# EAGLE design board (EAGLE 9.3.0)
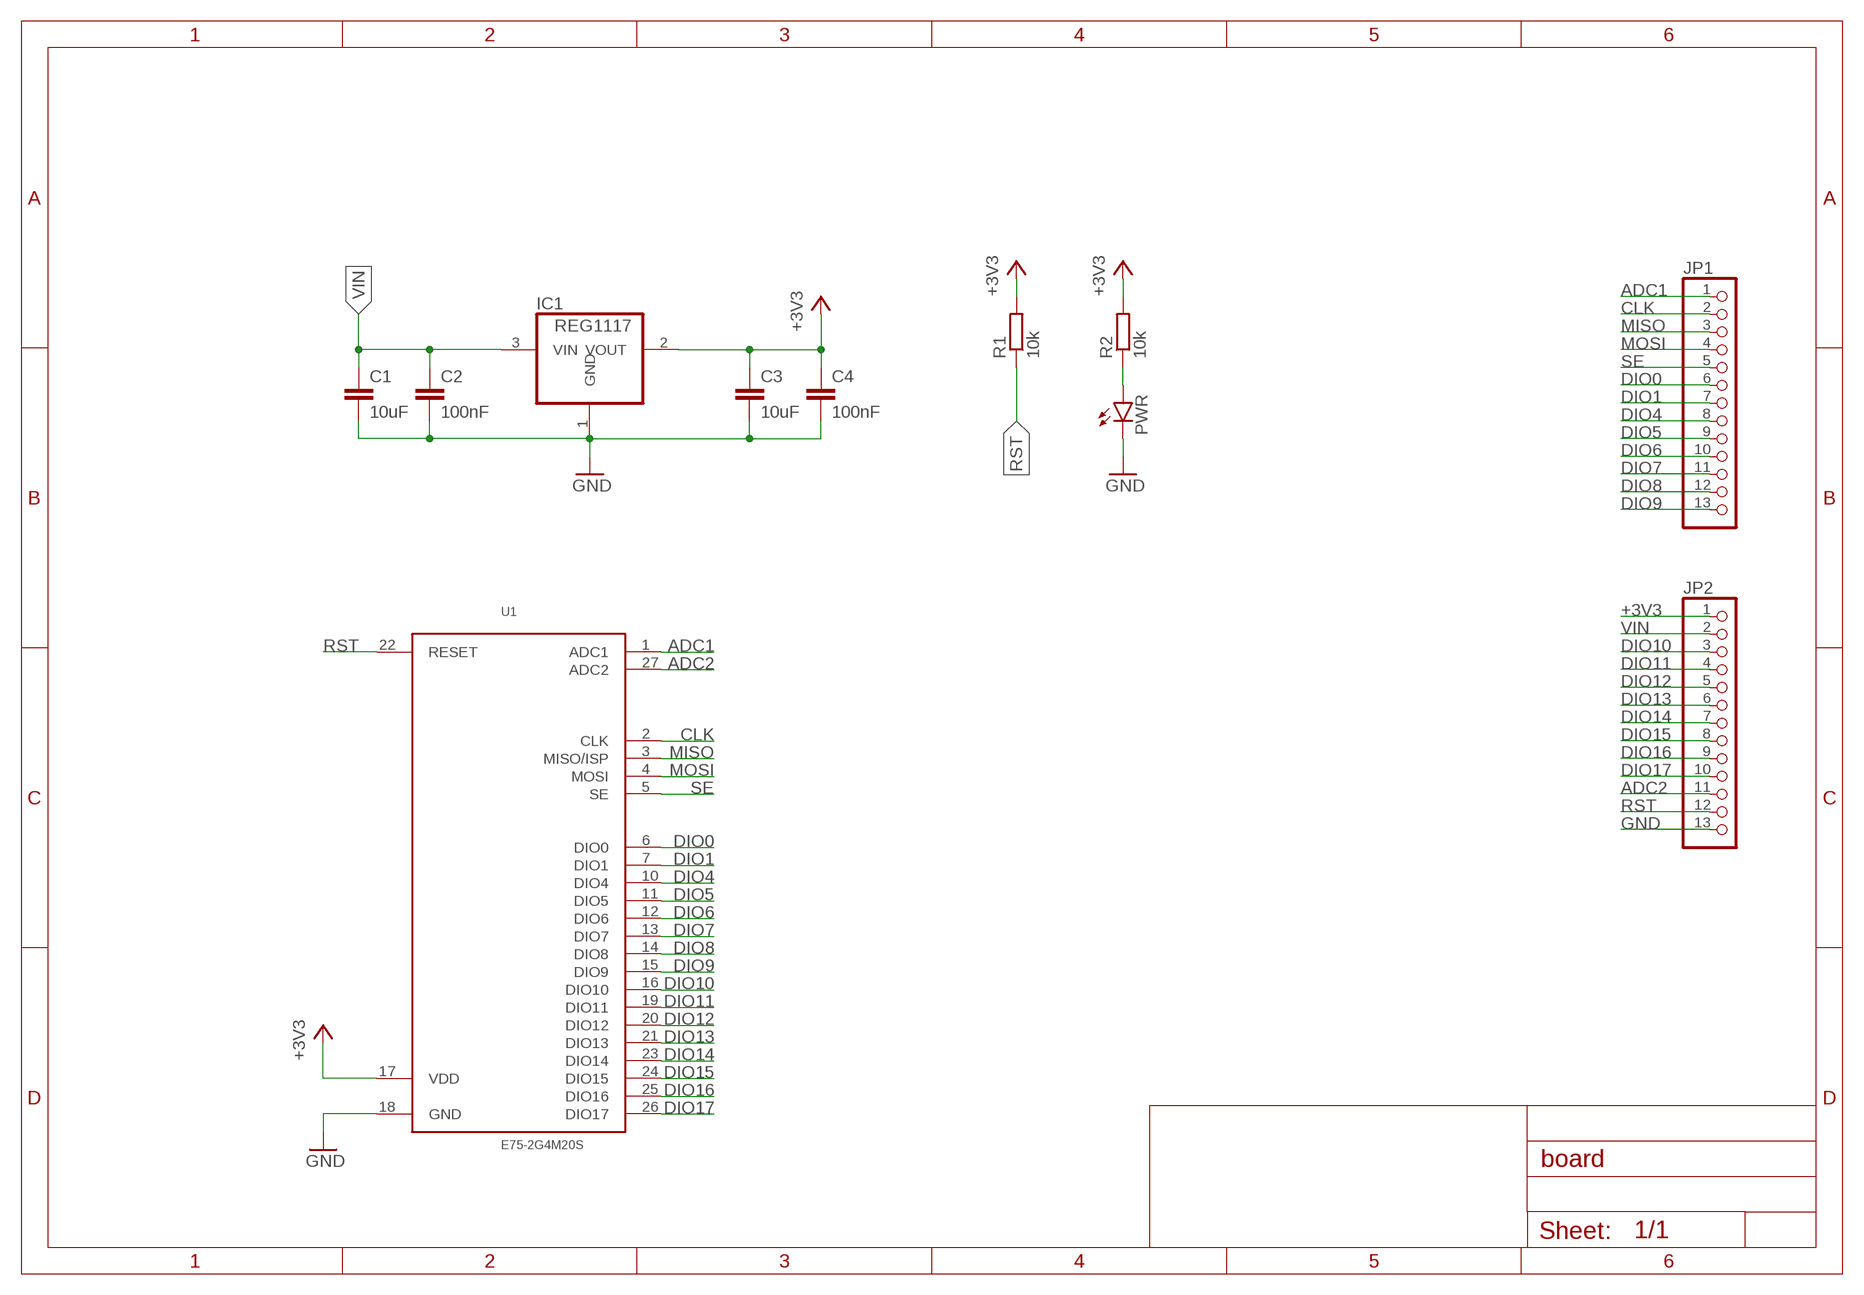
[diagram p0: schematic, sheet 1]

## Parts
C1  10uF  C-EUC0603  [C0603]
C2  100nF  C-EUC0603  [C0603]
C3  10uF  C-EUC0603  [C0603]
C4  100nF  C-EUC0603  [C0603]
IC1  REG1117  [SOT223]
JP1  PINHD-1X13  [1X13]
JP2  PINHD-1X13  [1X13]
PWR  LEDSML0603  [SML0603]
R1  10k  R-EU_R0603  [R0603]
R2  10k  R-EU_R0603  [R0603]
U1  E75-2G4M20S  [E75-2G4M20S]

## Nets
+3V3: C3.1 C4.1 IC1.2(VOUT) JP2.1 R1.2 R2.2 U1.17(VDD)
ADC1: JP1.1 U1.1(ADC1)
ADC2: JP2.11 U1.27(ADC2)
CLK: JP1.2 U1.2(CLK)
DIO0: JP1.6 U1.6(DIO0)
DIO1: JP1.7 U1.7(DIO1)
DIO4: JP1.8 U1.10(DIO4)
DIO5: JP1.9 U1.11(DIO5)
DIO6: JP1.10 U1.12(DIO6)
DIO7: JP1.11 U1.13(DIO7)
DIO8: JP1.12 U1.14(DIO8)
DIO9: JP1.13 U1.15(DIO9)
DIO10: JP2.3 U1.16(DIO10)
DIO11: JP2.4 U1.19(DIO11)
DIO12: JP2.5 U1.20(DIO12)
DIO13: JP2.6 U1.21(DIO13)
DIO14: JP2.7 U1.23(DIO14)
DIO15: JP2.8 U1.24(DIO15)
DIO16: JP2.9 U1.25(DIO16)
DIO17: JP2.10 U1.26(DIO17)
GND: C1.2 C2.2 C3.2 C4.2 IC1.1(GND) JP2.13 PWR.C U1.18(GND)
MISO: JP1.3 U1.3(MISO/ISP)
MOSI: JP1.4 U1.4(MOSI)
N$1: PWR.A R2.1
RST: JP2.12 R1.1 U1.22(RESET)
SE: JP1.5 U1.5(SE)
VIN: C1.1 C2.1 IC1.3(VIN) JP2.2

## Library data of the parts
C1-C4 = rcl:C-EU: CAPACITOR, European symbol; SPICEPREFIX: C
IC1 = burr-brown:REG1117: 800mA and 1A Low Dropout (LDO) Positive Regulator 1.8V, 2.5V, 2.85V, 3.3V, 5V, and Adj; MPN: REG1117; OC_FARNELL: 1097566; OC_NEWARK: 14P6981
JP1 JP2 = pinhead:PINHD-1X13: PIN HEADER
PWR = led:LED: LED OSRAM: - CHIPLED LG R971, LG N971, LY N971, LG Q971, LY Q971, LO R971, LY R971 LH N974, LH R974 LS Q976, LO Q976, LY Q976 LO Q996 - Hyper CHIPLED LW Q18S LB Q993, LB Q99A, LB R99A - SideLED LS A670, LO A670, LY A670, LG A670, LP A670 LB A673, LV A673, LT A673, LW A673 LH A674 LY A675 LS A676, LA A676, LO A676, LY A676, LW A676 LS A679, LY A679, LG A679 - Hyper Micro SIDELED® LS Y876, LA Y876, LO Y876, LY Y876 LT Y87S - SmartLED LW L88C, LW L88S LB L89C, LB L89S, LG L890 LS L89K, LO L89K, LY L89K LS L896, LA L896, LO L896, LY L896 - TOPLED LS T670, LO T670, LY T670, LG T670, LP T670 LSG T670, LSP T670, LSY T670, LOP T670, LYG T670 LG T671, LOG T671, LSG T671 LB T673, LV T673, LT T673, LW T673 LH T674 LS T676, LA T676, LO T676, LY T676, LB T676, LH T676, LSB T676, LW T676 LB T67C, LV T67C, LT T67C, LS T67K, LO T67K, LY T67K, LW E67C LS E67B, LA E67B, LO E67B, LY E67B, LB E67C, LV E67C, LT E67C LW T67C LS T679, LY T679, LG T679 LS T770, LO T770, LY T770, LG T770, LP T770 LB T773, LV T773, LT T773, LW T773 LH T774 LS E675, LA E675, LY E675, LS T675 LS T776, LA T776, LO T776, LY T776, LB T776 LHGB T686 LT T68C, LB T68C - Hyper Mini TOPLED® LB M676 - Mini TOPLED Santana® LG M470 LS M47K, LO M47K, LY M47K Source: http://www.osram.convergy.de LUXEON: - LUMILED® LXK2-PW12-R00, LXK2-PW12-S00, LXK2-PW14-U00, LXK2-PW14-V00 LXK2-PM12-R00, LXK2-PM12-S00, LXK2-PM14-U00 LXK2-PE12-Q00, LXK2-PE12-R00, LXK2-PE12-S00, LXK2-PE14-T00, LXK2-PE14-U00 LXK2-PB12-K00, LXK2-PB12-L00, LXK2-PB12-M00, LXK2-PB14-N00, LXK2-PB14-P00, LXK2-PB14-Q00 LXK2-PR12-L00, LXK2-PR12-M00, LXK2-PR14-Q00, LXK2-PR14-R00 LXK2-PD12-Q00, LXK2-PD12-R00, LXK2-PD12-S00 LXK2-PH12-R00, LXK2-PH12-S00 LXK2-PL12-P00, LXK2-PL12-Q00, LXK2-PL12-R00 Source: www.luxeon.com KINGBRIGHT: KA-3528ASYC Source: www.kingbright.com
R1 R2 = rcl:R-EU_: RESISTOR, European symbol; SPICEPREFIX: R
U1 = E75-2G4M20S:E75-2G4M20S

## Board
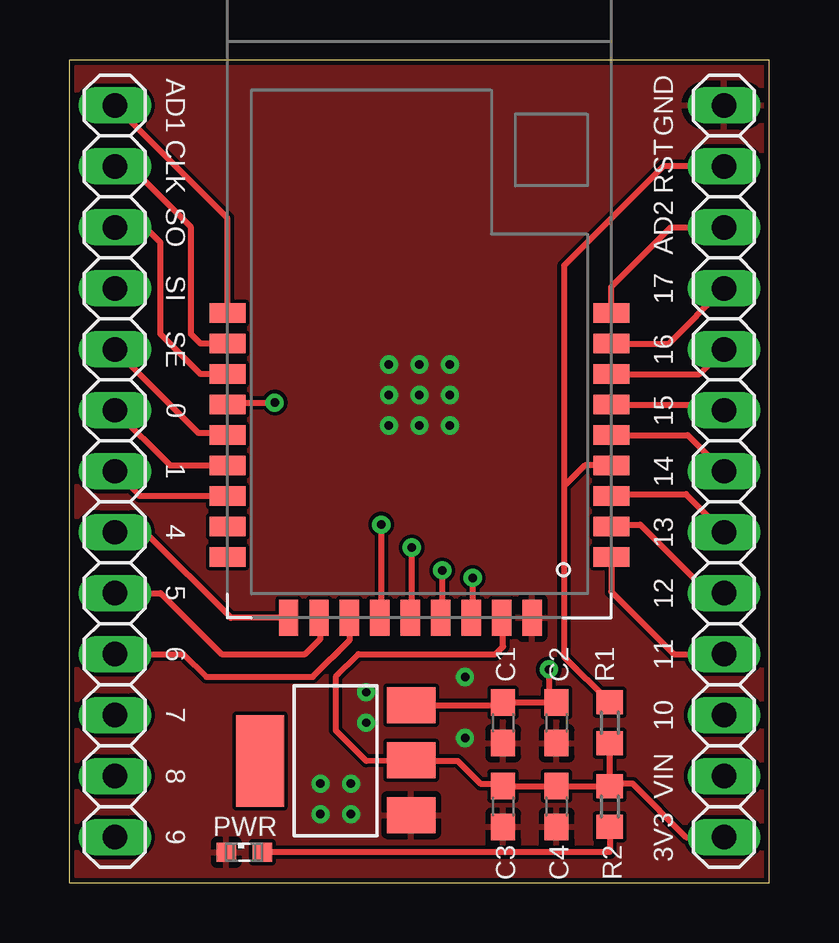
[diagram p1: board, top side]
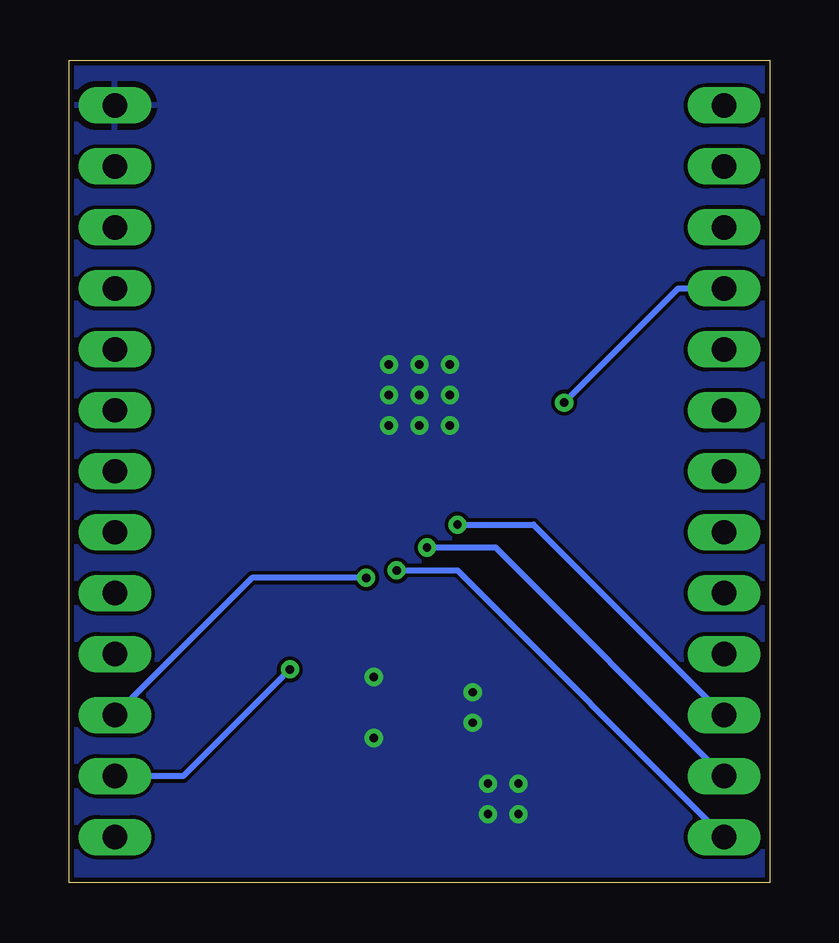
[diagram p2: board, bottom side, seen from below]

Size 29.2 x 34.28 mm. Coordinates in mm from the lower left corner, seen from the top.
Outline: 0,0 29.2,0 29.2,34.28 0,34.28 0,0
Copper layers (1*16): Top 0.035mm / dielectric 1.5mm / Bottom 0.035mm
Design rules "default *": minimum track width 6mil, minimum drill 0.35mm, track to track 6mil, track to pad 6mil, pad to pad 6mil, via to via 12mil, smd to smd 6mil, copper to edge 8mil, drill to drill 6mil, minimum pad ring 10mil, minimum via ring 8mil, stop-mask expansion 4mil, vias tented up to drill 0mil, thermal gap 10mil

### Footprints (pad centres in the part's own frame; a part is rotated, then mirrored left to right if it is on the bottom)
C0603 = smd 1.1 x 1: 1 -0.85,0; 2 0.85,0
SOT223 = smd 1.499 x 2.007: 1 -2.261,-3.15; 2 0.025,-3.15; 3 2.311,-3.15 | smd 3.81 x 2.007: 4 0,3.15
1X13 = drill 1.016 long: 1 -15.24,0; 2 -12.7,0; 3 -10.16,0; 4 -7.62,0; 5 -5.08,0; 6 -2.54,0; 7 0,0; 8 2.54,0; 9 5.08,0; 10 7.62,0; 11 10.16,0; 12 12.7,0; 13 15.24,0
SML0603 = smd 0.8 x 0.8: A 0.75,0; C -0.75,0
R0603 = smd 1 x 1.1: 1 -0.85,0; 2 0.85,0
E75-2G4M20S = smd 1.5 x 0.8: 1 8,2.3; 2 8,3.57; 3 8,4.84; 4 8,6.11; 5 8,7.38; 6 8,8.65; 7 8,9.92; 8 8,11.19; 9 8,12.46; 19 -8,12.46; 20 -8,11.19; 21 -8,9.92; 22 -8,8.65; 23 -8,7.38; 24 -8,6.11; 25 -8,4.84; 26 -8,3.57; 27 -8,2.3 | smd 0.8 x 1.5: 10 5.46,15; 11 4.19,15; 12 2.92,15; 13 1.65,15; 14 0.38,15; 15 -0.89,15; 16 -2.16,15; 17 -3.43,15; 18 -4.7,15

### Placement (x,y rotation side)
C1  18.1,6.67 270 top
C2  20.32,6.67 270 top
C3  18.1,3.17 270 top
C4  20.32,3.17 270 top
IC1  11.11,5.08 90 top
JP1  1.91,17.14 270 top
JP2  27.3,17.14 90 top
PWR  7.3,1.27 0 top
R1  22.54,6.67 270 top
R2  22.54,3.17 90 top
U1  14.61,26.04 180 top

### Tracks (layer width: path | path; a pad name or v marks a point on that pad's centre or on a via)
+3V3
  Top 0.254: U1.17 18.1,11.04 18.1,9.84 17.78,9.53 12.06,9.53 11.11,8.57 11.11,6.35 12.38,5.08 IC1.2 14.29,5.08 16.19,5.08 17.14,4.13 18,4.13 C3.1 C4.1 R2.2 | R2.2 R1.2 | R2.2 22.64,4.13 23.5,4.13 25.72,1.91 JP2.1
ADC1
  Top 0.254: U1.1 6.61,27.68 JP1.1
ADC2
  Top 0.254: U1.27 22.61,24.83 25.08,27.3 JP2.11
CLK
  Top 0.254: JP1.2 2.54,29.84 5.08,27.3 5.08,22.86 5.47,22.46 U1.2
DIO0
  Top 0.254: JP1.6 4.21,17.39 U1.6
DIO1
  Top 0.254: JP1.7 2.94,16.11 U1.7
DIO4
  Top 0.254: U1.10 6.75,11.04 3.17,14.61 JP1.8
DIO5
  Top 0.254: JP1.9 3.81,12.06 6.35,9.53 9.84,9.53 10.48,10.16 10.48,10.97 U1.11
DIO6
  Top 0.254: U1.12 11.69,10.1 10.16,8.57 5.71,8.57 4.76,9.53 JP1.10
DIO7  (via drill 0.35)
  Top 0.254: U1.13 13.02,11.04 v13.02,14.92
  Bottom 0.254: v13.02,14.92 9.84,14.92 JP1.11
DIO8  (via drill 0.35)
  Top 0.254: U1.14 14.29,11.04 v14.29,13.97
  Bottom 0.254: v14.29,13.97 11.43,13.97 JP1.12
DIO9  (via drill 0.35)
  Top 0.254: U1.15 15.56,11.04 v15.56,13.02
  Bottom 0.254: v15.56,13.02 13.02,13.02 JP1.13
DIO10  (via drill 0.35)
  Top 0.254: U1.16 16.83,11.04 v16.83,12.7
  Bottom 0.254: v16.83,12.7 21.59,12.7 JP2.3
DIO11
  Top 0.254: U1.19 22.61,12.13 25.21,9.53 JP2.4
DIO12
  Top 0.254: U1.20 22.68,14.92 23.81,14.92 26.67,12.06 JP2.5
DIO13
  Top 0.254: U1.21 22.68,16.19 25.72,16.19 JP2.6
DIO14
  Top 0.254: U1.23 25.8,18.66 JP2.7
DIO15
  Top 0.254: U1.24 27.07,19.93 JP2.8
DIO16
  Top 0.254: U1.25 26.27,21.2 JP2.9
DIO17
  Top 0.254: U1.26 25,22.46 JP2.10
GND  (via drill 0.35)
  other vias: 10.48,4.13 11.75,4.13 11.75,2.86 10.48,2.86 13.34,19.05 14.61,19.05 13.34,21.59 14.61,21.59 15.88,21.59 13.34,20.32 14.61,20.32 15.88,20.32 15.88,19.05 16.51,8.57 16.51,6.03 12.38,6.67 12.38,7.94
  pour Top: 0,34.29 0,0 29.21,0 29.21,34.29
  pour Bottom: 0,34.29 29.21,34.29 29.21,0 0,0
MISO
  Top 0.254: JP1.3 3.17,27.3 3.81,26.67 3.81,22.86 5.47,21.2 U1.3
MOSI  (via drill 0.35)
  Top 0.254: U1.4 6.61,20 v8.57,20
  Bottom 0.254: v8.57,20 3.81,24.77 JP1.4
N$1
  Top 0.254: R2.1 22.54,1.27 PWR.A
RST
  Top 0.254: R1.1 20.64,9.42 20.64,16.51 | U1.22 21.51,17.39 20.64,16.51 | JP2.12 24.77,29.84 20.64,25.72 20.64,16.51
SE
  Top 0.254: U1.5 6.53,18.73 5.4,18.73 JP1.5
VIN  (via drill 0.35)
  Top 0.254: IC1.3 17.97,7.39 C1.1 C2.1 20,7.83 v20,8.89
  Bottom 0.254: v20,8.89 24.45,4.45 JP2.2

### Text on the board
tPlace: AD1 | GND | CLK | RST | SO | AD2 | SI | 17 | SE | 16 | 0 | 15 | 1 | 14 | 4 | 13 | 5 | 12 | 6 | 11 | 7 | 10 | 8 | VIN | 9 | 3V3